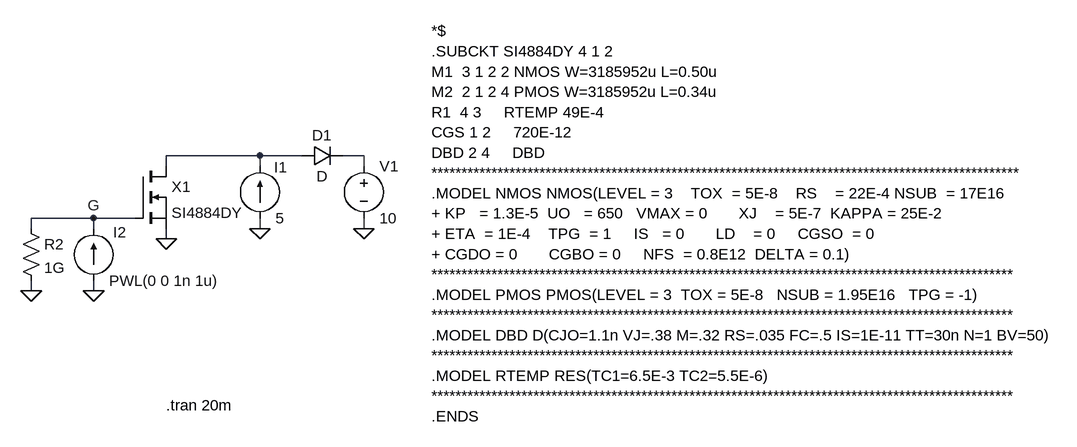
[diagram p0: schematic 4884Charge.asc]
4884Charge.asc, the LTspice schematic file:
Version 4
SHEET 1 2752 736
WIRE 1312 160 1168 160
WIRE 1376 160 1312 160
WIRE 1472 160 1440 160
WIRE 1168 176 1168 160
WIRE 1312 176 1312 160
WIRE 1472 176 1472 160
WIRE 1056 256 960 256
WIRE 1120 256 1056 256
WIRE 960 272 960 256
WIRE 1056 272 1056 256
WIRE 1312 272 1312 256
WIRE 1472 272 1472 256
WIRE 1168 288 1168 272
WIRE 960 368 960 352
WIRE 1056 368 1056 352
FLAG 1168 288 0
FLAG 1472 272 0
FLAG 1312 272 0
FLAG 1056 368 0
FLAG 960 368 0
FLAG 1056 256 G
SYMBOL nmos 1120 176 R0
SYMATTR InstName X1
SYMATTR Value SI4884DY
SYMATTR Prefix X
SYMBOL voltage 1472 160 R0
SYMATTR InstName V1
SYMATTR Value 10
SYMBOL current 1312 256 M180
WINDOW 0 22 78 Left 0
WINDOW 3 24 0 Left 0
SYMATTR InstName I1
SYMATTR Value 5
SYMBOL diode 1376 144 M90
WINDOW 0 0 32 VBottom 0
WINDOW 3 32 32 VTop 0
SYMATTR InstName D1
SYMBOL current 1056 352 M180
WINDOW 0 30 74 Left 0
WINDOW 3 24 0 Left 0
SYMATTR InstName I2
SYMATTR Value PWL(0 0 1n 1u)
SYMBOL res 944 256 R0
SYMATTR InstName R2
SYMATTR Value 1G
TEXT 1168 544 Left 0 !.tran 20m
TEXT 1576 -32 Left 0 !*$\n.SUBCKT SI4884DY 4 1 2\nM1  3 1 2 2 NMOS W=3185952u L=0.50u \nM2  2 1 2 4 PMOS W=3185952u L=0.34u\nR1  4 3     RTEMP 49E-4\nCGS 1 2     720E-12\nDBD 2 4     DBD\n**************************************************************************************************\n.MODEL NMOS NMOS(LEVEL = 3    TOX  = 5E-8    RS    = 22E-4 NSUB  = 17E16\n+ KP   = 1.3E-5  UO   = 650   VMAX = 0       XJ    = 5E-7  KAPPA = 25E-2\n+ ETA  = 1E-4    TPG  = 1     IS   = 0       LD    = 0     CGSO  = 0\n+ CGDO = 0       CGBO = 0     NFS  = 0.8E12  DELTA = 0.1)\n*************************************************************************************************\n.MODEL PMOS PMOS(LEVEL = 3  TOX = 5E-8   NSUB = 1.95E16   TPG = -1) \n*************************************************************************************************\n.MODEL DBD D(CJO=1.1n VJ=.38 M=.32 RS=.035 FC=.5 IS=1E-11 TT=30n N=1 BV=50)\n*************************************************************************************************\n.MODEL RTEMP RES(TC1=6.5E-3 TC2=5.5E-6)\n*************************************************************************************************\n.ENDS

The netlist it stands for:
* 4884Charge.asc
XX1 N001 G 0 SI4884DY  ; pins D G S
V1 N002 0 10
I1 0 N001 5
D1 N001 N002 D
I2 0 G PWL(0 0 1n 1u)
R2 G 0 1G
.model D D
.lib standard.dio
.tran 20m
*$
.SUBCKT SI4884DY 4 1 2
M1  3 1 2 2 NMOS W=3185952u L=0.50u
M2  2 1 2 4 PMOS W=3185952u L=0.34u
R1  4 3     RTEMP 49E-4
CGS 1 2     720E-12
DBD 2 4     DBD
**************************************************************************************************
.MODEL NMOS NMOS(LEVEL = 3    TOX  = 5E-8    RS    = 22E-4 NSUB  = 17E16
+ KP   = 1.3E-5  UO   = 650   VMAX = 0       XJ    = 5E-7  KAPPA = 25E-2
+ ETA  = 1E-4    TPG  = 1     IS   = 0       LD    = 0     CGSO  = 0
+ CGDO = 0       CGBO = 0     NFS  = 0.8E12  DELTA = 0.1)
*************************************************************************************************
.MODEL PMOS PMOS(LEVEL = 3  TOX = 5E-8   NSUB = 1.95E16   TPG = -1)
*************************************************************************************************
.MODEL DBD D(CJO=1.1n VJ=.38 M=.32 RS=.035 FC=.5 IS=1E-11 TT=30n N=1 BV=50)
*************************************************************************************************
.MODEL RTEMP RES(TC1=6.5E-3 TC2=5.5E-6)
*************************************************************************************************
.ENDS
.backanno
.end